# Altium schematic sheet MB_RELAY.SchDoc
size A4
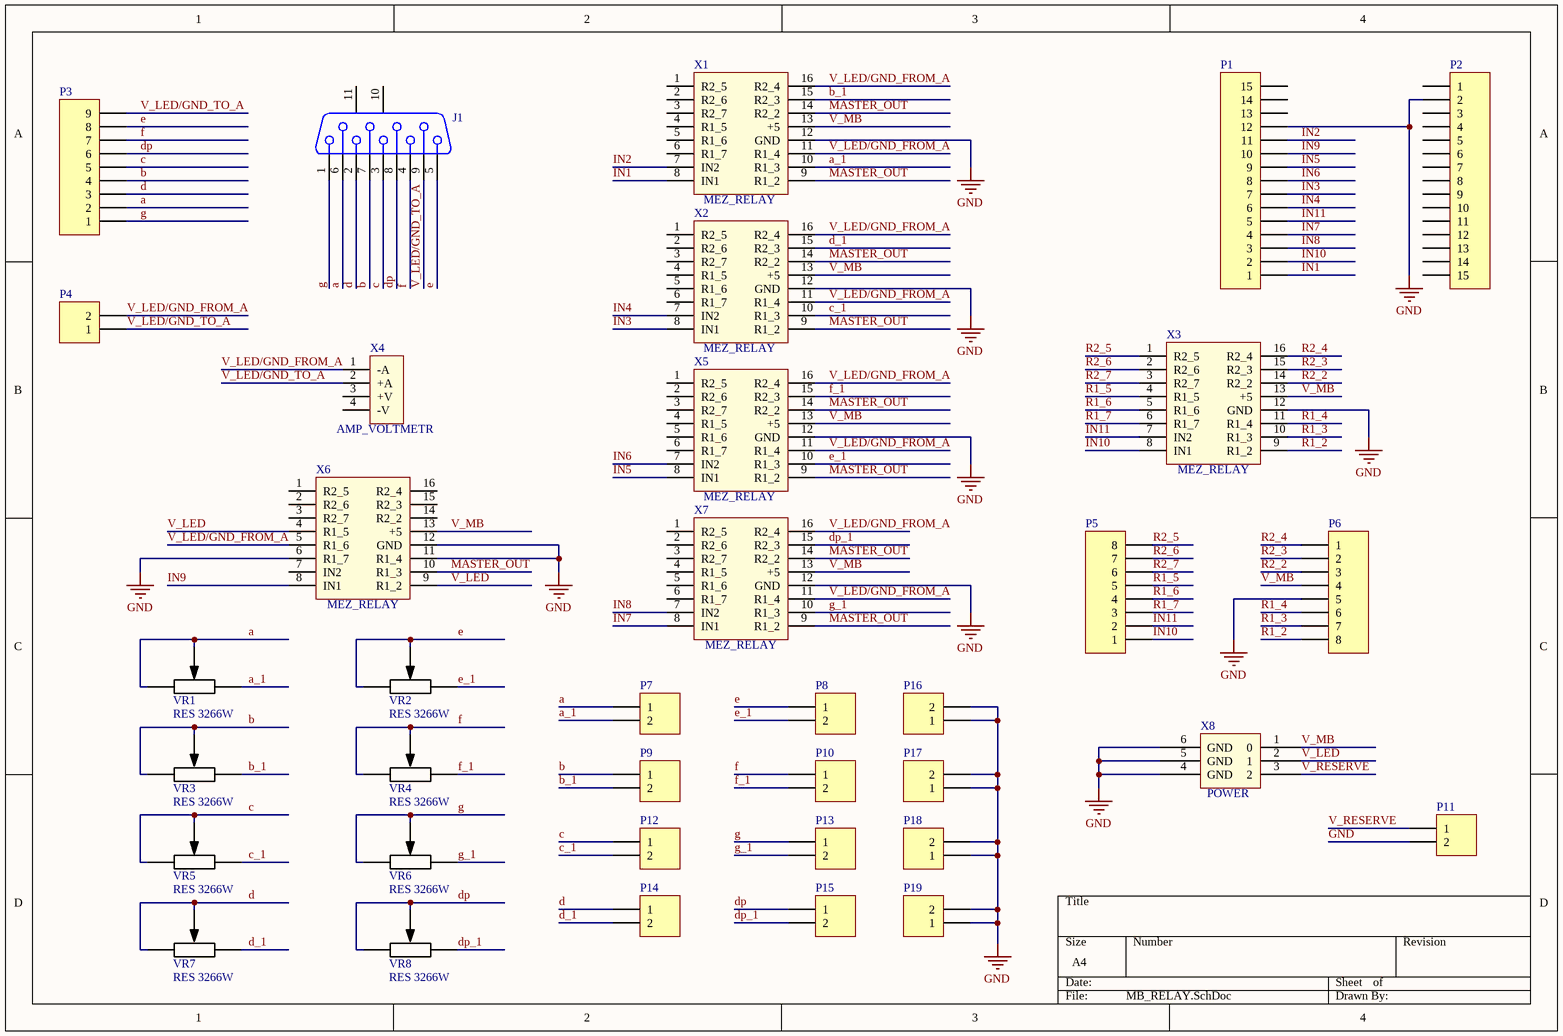
[diagram p0: MB_RELAY.SchDoc]

## Parts
J1  D Connector 9  [DSUB1.385-2H9]  (value not drawn)
P1  Header 15  [HDR1X15]  (value not drawn)
P2  Header 15  [HDR1X15]  (value not drawn)
P3  Header 9  [HDR1X9]  (value not drawn)
P4  Header 2  [HDR1X2]  (value not drawn)
P5  Header 8  [HDR1X8]  (value not drawn)
P6  Header 8  [HDR1X8]  (value not drawn)
P7  Header 2  [HDR1X2]  (value not drawn)
P8  GND  [HDR1X2]  (value not drawn)
P9  Header 2  [HDR1X2]  (value not drawn)
P10  GND  [HDR1X2]  (value not drawn)
P11  Header 2  [HDR1X2]  (value not drawn)
P12  Header 2  [HDR1X2]  (value not drawn)
P13  GND  [HDR1X2]  (value not drawn)
P14  Header 2  [HDR1X2]  (value not drawn)
P15  GND  [HDR1X2]  (value not drawn)
P16  GND  [HDR1X2]  (value not drawn)
P17  GND  [HDR1X2]  (value not drawn)
P18  GND  [HDR1X2]  (value not drawn)
P19  GND  [HDR1X2]  (value not drawn)
VR1  RES 3266W  [RES 3266W]
VR2  RES 3266W  [RES 3266W]
VR3  RES 3266W  [RES 3266W]
VR4  RES 3266W  [RES 3266W]
VR5  RES 3266W  [RES 3266W]
VR6  RES 3266W  [RES 3266W]
VR7  RES 3266W  [RES 3266W]
VR8  RES 3266W  [RES 3266W]
X1  MEZ_RELAY  [MEZ_RELAY]
X2  MEZ_RELAY  [MEZ_RELAY]
X3  MEZ_RELAY  [MEZ_RELAY]
X4  AMP_VOLTMETR  [AMP_VOLTMETER]
X5  MEZ_RELAY  [MEZ_RELAY]
X6  MEZ_RELAY  [MEZ_RELAY]
X7  MEZ_RELAY  [MEZ_RELAY]
X8  POWER  [POWER]

## Nets
GND: P1.12 P2.2 P6.5 P11.2 P16.1 P16.2 P17.1 P17.2 P18.1 P18.2 P19.1 P19.2 X1.12(GND) X2.12(GND) X3.12(GND) X5.12(GND) X6.6(R1_7) X6.11(R1_4) X6.12(GND) X7.12(GND) X8.4(GND) X8.5(GND) X8.6(GND)
a: J1.6 P3.2 P7.1 VR1.1 VR1.2
a_1: P7.2 VR1.3 X1.10(R1_3)
b: J1.7 P3.4 P9.1 VR3.1 VR3.2
b_1: P9.2 VR3.3 X1.15(R2_3)
c: J1.3 P3.5 P12.1 VR5.1 VR5.2
c_1: P12.2 VR5.3 X2.10(R1_3)
d: J1.2 P3.3 P14.1 VR7.1 VR7.2
d_1: P14.2 VR7.3 X2.15(R2_3)
dp: J1.8 P3.6 P15.1 VR8.1 VR8.2
dp_1: P15.2 VR8.3 X7.15(R2_3)
e: J1.5 P3.8 P8.1 VR2.1 VR2.2
e_1: P8.2 VR2.3 X5.10(R1_3)
f: J1.4 P3.7 P10.1 VR4.1 VR4.2
f_1: P10.2 VR4.3 X5.15(R2_3)
g: J1.1 P3.1 P13.1 VR6.1 VR6.2
g_1: P13.2 VR6.3 X7.10(R1_3)
IN1: P1.1 X1.8(IN1)
IN2: P1.11 X1.7(IN2)
IN3: P1.7 X2.8(IN1)
IN4: P1.6 X2.7(IN2)
IN5: P1.9 X5.8(IN1)
IN6: P1.8 X5.7(IN2)
IN7: P1.4 X7.8(IN1)
IN8: P1.3 X7.7(IN2)
IN9: P1.10 X6.8(IN1)
IN10: P1.2 P5.1 X3.8(IN1)
IN11: P1.5 P5.2 X3.7(IN2)
MASTER_OUT: X1.9(R1_2) X1.14(R2_2) X2.9(R1_2) X2.14(R2_2) X5.9(R1_2) X5.14(R2_2) X6.10(R1_3) X7.9(R1_2) X7.14(R2_2)
R1_2: P6.8 X3.9(R1_2)
R1_3: P6.7 X3.10(R1_3)
R1_4: P6.6 X3.11(R1_4)
R1_5: P5.5 X3.4(R1_5)
R1_6: P5.4 X3.5(R1_6)
R1_7: P5.3 X3.6(R1_7)
R2_2: P6.3 X3.14(R2_2)
R2_3: P6.2 X3.15(R2_3)
R2_4: P6.1 X3.16(R2_4)
R2_5: P5.8 X3.1(R2_5)
R2_6: P5.7 X3.2(R2_6)
R2_7: P5.6 X3.3(R2_7)
V_LED: X6.4(R1_5) X6.9(R1_2) X8.2(1)
V_LED/GND_FROM_A: P4.2 X1.11(R1_4) X1.16(R2_4) X2.11(R1_4) X2.16(R2_4) X4.1(-A) X5.11(R1_4) X5.16(R2_4) X6.5(R1_6) X7.11(R1_4) X7.16(R2_4)
V_LED/GND_TO_A: J1.9 P3.9 P4.1 X4.2(+A)
V_MB: P6.4 X1.13(+5) X2.13(+5) X3.13(+5) X5.13(+5) X6.13(+5) X7.13(+5) X8.1(0)
V_RESERVE: P11.1 X8.3(2)

Not connected (* = marked no-connect by the designer): J1 10(MH1) 11(MH2); P1 13 14 15; P2 1 3 4 5 6 7 8 9 10 11 12 13 14 15; X1 1(R2_5) 2(R2_6) 3(R2_7) 4(R1_5) 5(R1_6) 6(R1_7); X2 1(R2_5) 2(R2_6) 3(R2_7) 4(R1_5) 5(R1_6) 6(R1_7); X4 3(+V) 4(-V); X5 1(R2_5) 2(R2_6) 3(R2_7) 4(R1_5) 5(R1_6) 6(R1_7); X6 1(R2_5) 2(R2_6) 3(R2_7) 7(IN2) 14(R2_2) 15(R2_3) 16(R2_4); X7 1(R2_5) 2(R2_6) 3(R2_7) 4(R1_5) 5(R1_6) 6(R1_7)

## Library data of the parts
J1 = D Connector 9: Receptacle Assembly, 9 Position, Right Angle; PackageDocument: O; Positions: 9; Published: 15-Jun-2001; LatestRevisionDate: 17-Jul-2002; LatestRevisionNote: Re-released for DXP Platform.; DatasheetDocument: 1-Sep-1999; PackageReference: 788750; Publisher: Altium Limited; Orientation: Right Angle; Gender: Receptacle
P1 P2 = Header 15: Header, 15-Pin; LatestRevisionDate: 17-Jul-2002; LatestRevisionNote: Re-released for DXP Platform.; Publisher: Altium Limited
P3 = Header 9: Header, 9-Pin; LatestRevisionDate: 17-Jul-2002; LatestRevisionNote: Re-released for DXP Platform.; Publisher: Altium Limited
P4 P7-P19 = Header 2: Header, 2-Pin; LatestRevisionDate: 17-Jul-2002; LatestRevisionNote: Re-released for DXP Platform.; Publisher: Altium Limited
P5 P6 = Header 8: Header, 8-Pin; LatestRevisionDate: 17-Jul-2002; LatestRevisionNote: Re-released for DXP Platform.; Publisher: Altium Limited